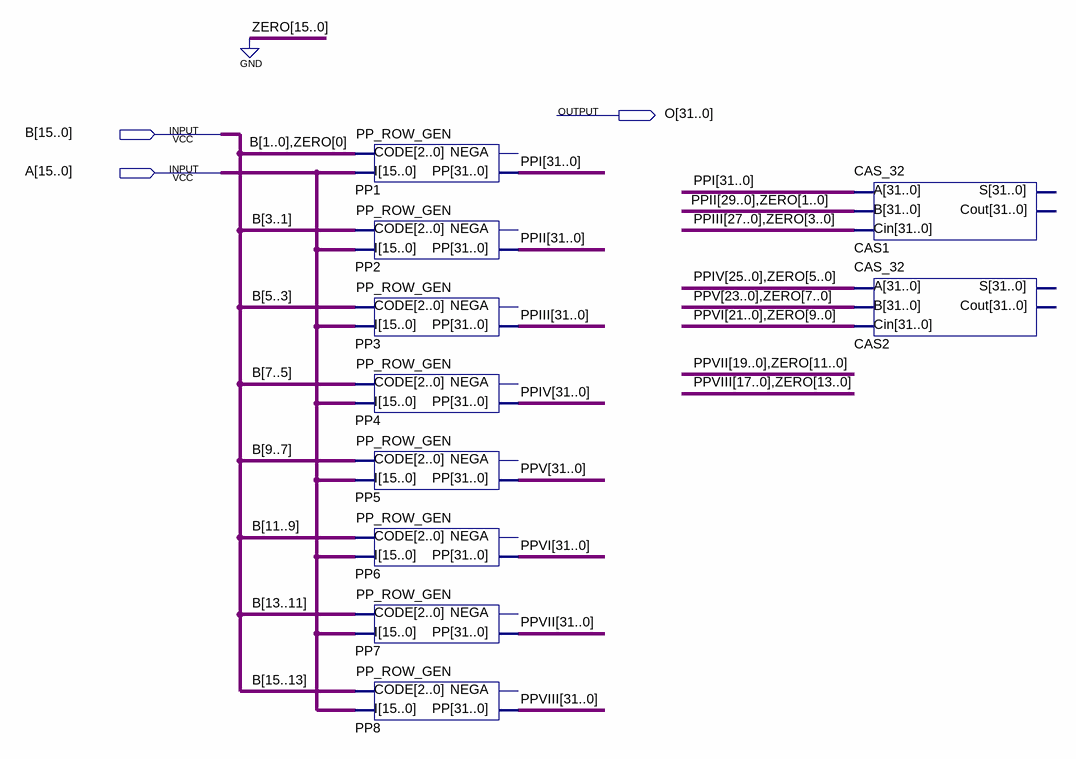
[diagram p0: schematic sheet]
// Quartus schematic newMult16.bdf as structural Verilog: 10 symbols, 3 pins
module newMult16 (
  input  [15:0] B,
  input  [15:0] A,
  output [31:0] O
);

  wire [31:0] PPI, PPII, PPIII, PPIV, PPV, PPVI, PPVII, PPVIII;

  PP_ROW_GEN PP1 (.CODE({B[1:0], 1'b0}), .I(A), .PP(PPI));  // open: NEGA
  PP_ROW_GEN PP2 (.CODE(B[3:1]), .I(A), .PP(PPII));  // open: NEGA
  PP_ROW_GEN PP3 (.CODE(B[5:3]), .I(A), .PP(PPIII));  // open: NEGA
  PP_ROW_GEN PP4 (.CODE(B[7:5]), .I(A), .PP(PPIV));  // open: NEGA
  PP_ROW_GEN PP5 (.CODE(B[9:7]), .I(A), .PP(PPV));  // open: NEGA
  PP_ROW_GEN PP6 (.CODE(B[11:9]), .I(A), .PP(PPVI));  // open: NEGA
  PP_ROW_GEN PP7 (.CODE(B[13:11]), .I(A), .PP(PPVII));  // open: NEGA
  PP_ROW_GEN PP8 (.CODE(B[15:13]), .I(A), .PP(PPVIII));  // open: NEGA
  CAS_32 CAS1 (.Cin({PPIII[27:0], 4'b0000}), .A(PPI), .B({PPII[29:0], 2'b00}));  // open: S, Cout
  CAS_32 CAS2 (
    .Cin({PPVI[21:0], {10{1'b0}}}), .A({PPIV[25:0], {6{1'b0}}}), .B({PPV[23:0], {8{1'b0}}}));  // open: S, Cout
endmodule
